# EAGLE schematic VT_adapter (EAGLE 8.1.1)
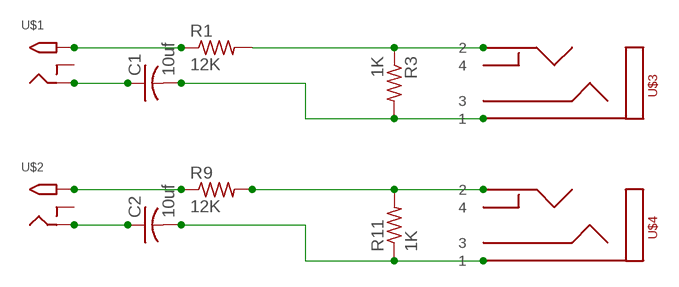
[diagram p0: schematic, sheet 1]

## Parts
C1  10uf  C-USC1206  [C1206]
C2  10uf  C-USC1206  [C1206]
R1  12K  R-US_R1206  [R1206]
R3  1K  R-US_R1206  [R1206]
R9  12K  R-US_R1206  [R1206]
R11  1K  R-US_R1206  [R1206]
U$1  2.1MMJACKSMT  [DCJACK_2MM_SMT]
U$2  2.1MMJACKSMT  [DCJACK_2MM_SMT]
U$3  STEREO_SMD  [STEREO_SMT]
U$4  STEREO_SMD  [STEREO_SMT]

## Nets
N$1: C1.2 R3.2 U$3.P$1
N$2: R1.2 R3.1 U$3.P$2
N$3: C1.1 U$1.GND(RING)
N$4: C2.1 U$2.GND(RING)
N$6: R1.1 U$1.PWR2(TIP)
N$7: R9.1 U$2.PWR2(TIP)
N$11: R9.2 R11.2 U$4.P$2
N$12: C2.2 R11.1 U$4.P$1
Unconnected: U$1.GNDBREAK(RING_SW) U$2.GNDBREAK(RING_SW) U$3.P$3 U$3.P$4 U$4.P$3 U$4.P$4

## Library data of the parts
C1 C2 = adafruit:C-US: CAPACITOR, American symbol
R1 R3 R9 R11 = resistor:R-US_: RESISTOR, American symbol
U$1 U$2 = CarbixEnergyMonitor_parts:2.1MMJACK: 2.1mm x 5.5mm THM DC jack with internal switch. Digikey part #PJ-102A, 4UCON part #05537 2.1mm x 5.5mm SMT DC jack with internal switch. Digikey part #PJ-002A-SMT, 4UCON part #03267 By microbuilder.eu & adafruit.com
U$3 U$4 = CarbixEnergyMonitor_parts:STEREO_SMD: 3.5mm Stereo Jack SMT